# EAGLE design bredtoob (EAGLE 9.6.2)
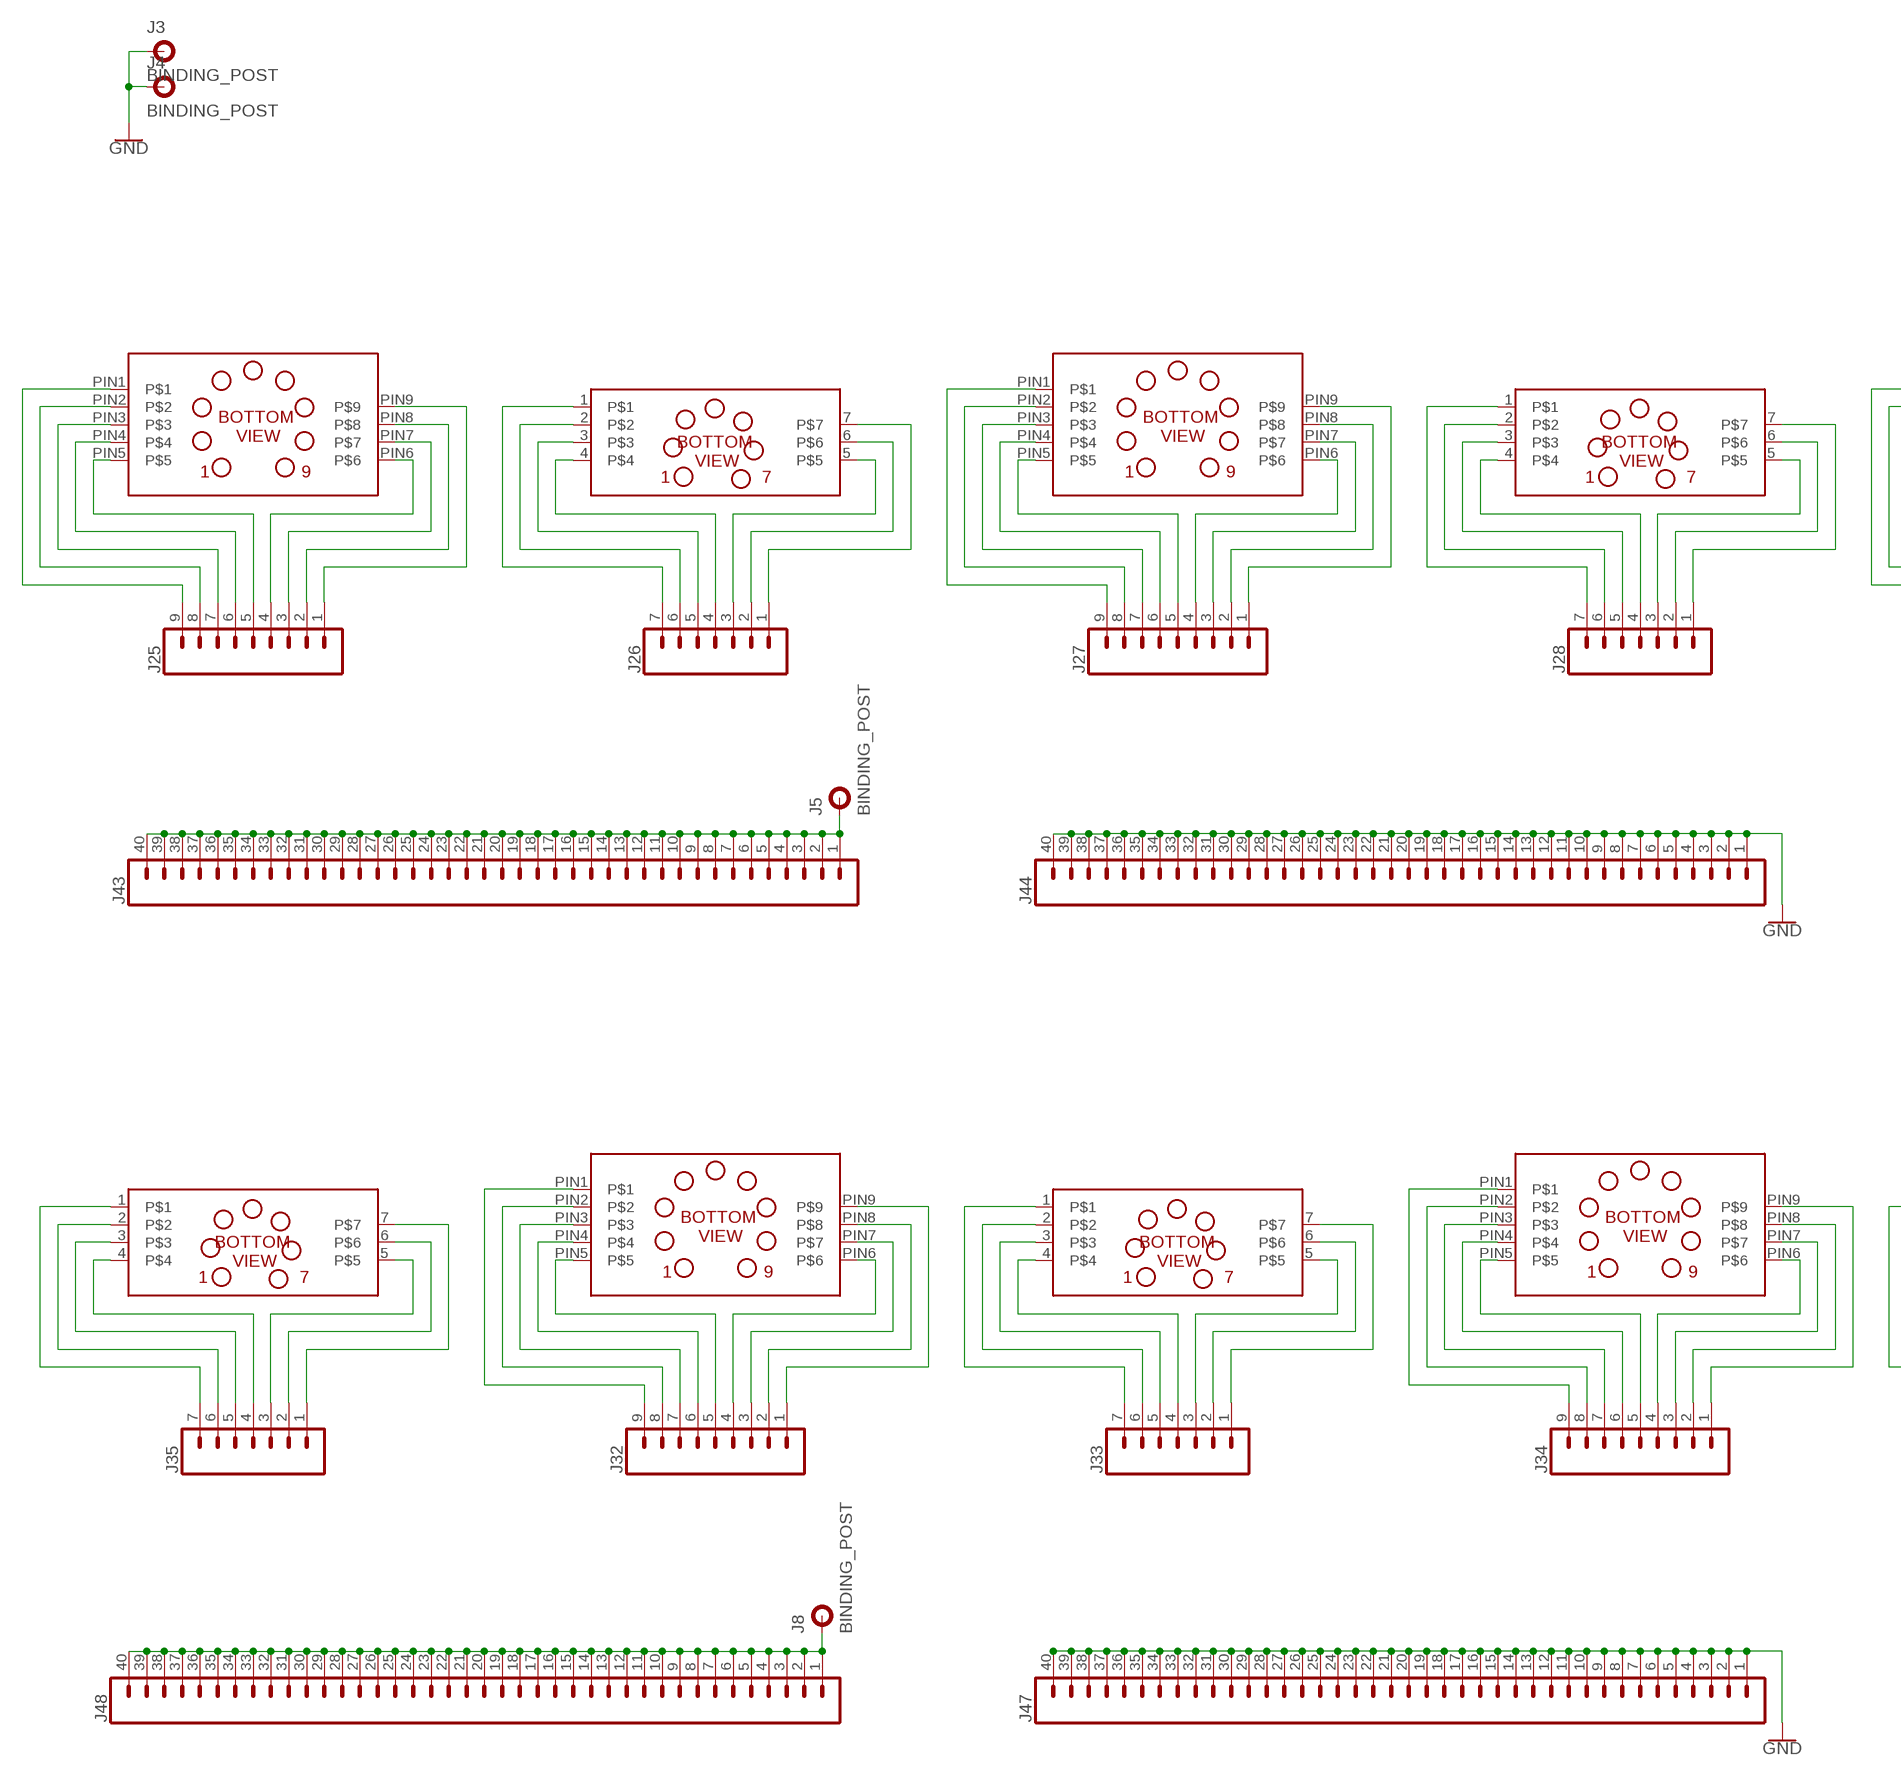
[diagram p0: schematic, sheet 1, part 1 of 2]
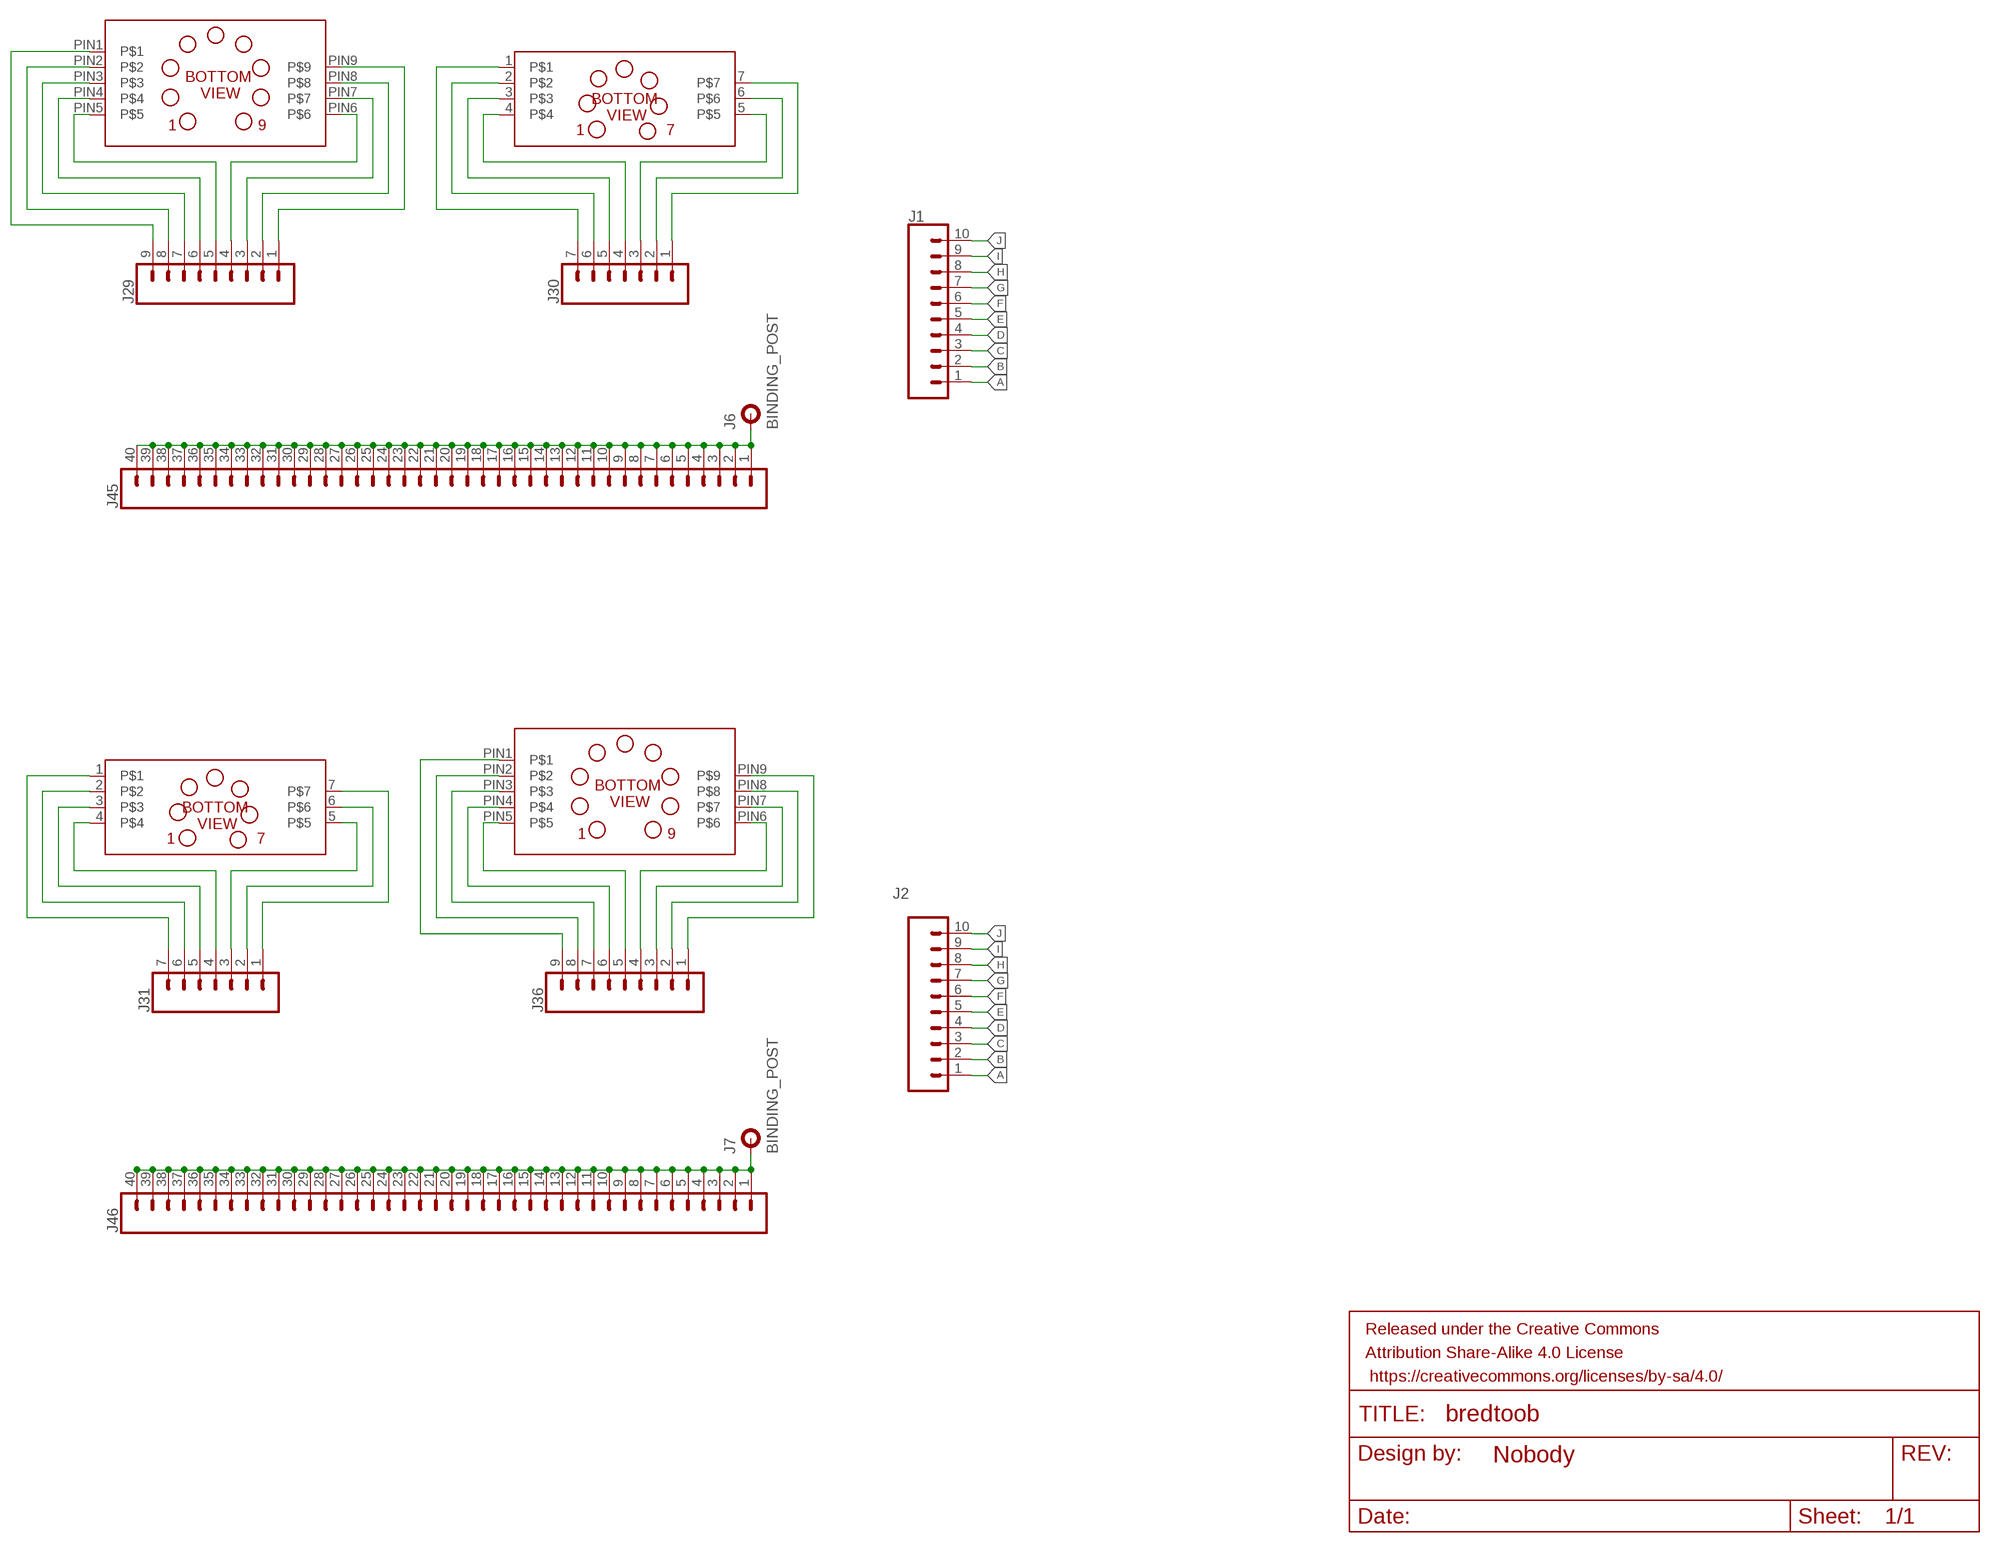
[diagram p1: schematic, sheet 1, part 2 of 2]

## Parts
FRAME1  FRAME-LETTERNO_PACKAGE  [DUMMY]
J1  CONN_10NO_SILK_PTH_FEMALE  [1X10_NO_SILK]
J2  CONN_10NO_SILK_PTH_FEMALE  [1X10_NO_SILK]
J3  BINDING_POST  [BINDING_POST]
J4  BINDING_POST  [BINDING_POST]
J5  BINDING_POST  [BINDING_POST]
J6  BINDING_POST  [BINDING_POST]
J7  BINDING_POST  [BINDING_POST]
J8  BINDING_POST  [BINDING_POST]
J25  CONN_09  [1X09]
J26  CONN_07NO_SILK  [1X07_NO_SILK]
J27  CONN_09  [1X09]
J28  CONN_07NO_SILK  [1X07_NO_SILK]
J29  CONN_09  [1X09]
J30  CONN_07NO_SILK  [1X07_NO_SILK]
J31  CONN_07NO_SILK  [1X07_NO_SILK]
J32  CONN_09  [1X09]
J33  CONN_07NO_SILK  [1X07_NO_SILK]
J34  CONN_09  [1X09]
J35  CONN_07NO_SILK  [1X07_NO_SILK]
J36  CONN_09  [1X09]
J43  CONN_40  [1X40]
J44  CONN_40  [1X40]
J45  CONN_40  [1X40]
J46  CONN_40  [1X40]
J47  CONN_40  [1X40]
J48  CONN_40  [1X40]
U$1  9PINMINI  [9-PIN-MINIATURE]
U$2  7PINMINI  [7-PIN-MINIATURE(B7G)]
U$3  9PINMINI  [9-PIN-MINIATURE]
U$4  7PINMINI  [7-PIN-MINIATURE(B7G)]
U$5  9PINMINI  [9-PIN-MINIATURE]
U$6  7PINMINI  [7-PIN-MINIATURE(B7G)]
U$7  7PINMINI  [7-PIN-MINIATURE(B7G)]
U$8  9PINMINI  [9-PIN-MINIATURE]
U$9  7PINMINI  [7-PIN-MINIATURE(B7G)]
U$10  9PINMINI  [9-PIN-MINIATURE]
U$11  7PINMINI  [7-PIN-MINIATURE(B7G)]
U$12  9PINMINI  [9-PIN-MINIATURE]

## Nets
A: J1.1 J2.1
B: J1.2 J2.2
C: J1.3 J2.3
D: J1.4 J2.4
E: J1.5 J2.5
F: J1.6 J2.6
G: J1.7 J2.7
GND: J3.P$1 J4.P$1 J44.1 J44.2 J44.3 J44.4 J44.5 J44.6 J44.7 J44.8 J44.9 J44.10 J44.11 J44.12 J44.13 J44.14 J44.15 J44.16 J44.17 J44.18 J44.19 J44.20 J44.21 J44.22 J44.23 J44.24 J44.25 J44.26 J44.27 J44.28 J44.29 J44.30 J44.31 J44.32 J44.33 J44.34 J44.35 J44.36 J44.37 J44.38 J44.39 J44.40 J47.1 J47.2 J47.3 J47.4 J47.5 J47.6 J47.7 J47.8 J47.9 J47.10 J47.11 J47.12 J47.13 J47.14 J47.15 J47.16 J47.17 J47.18 J47.19 J47.20 J47.21 J47.22 J47.23 J47.24 J47.25 J47.26 J47.27 J47.28 J47.29 J47.30 J47.31 J47.32 J47.33 J47.34 J47.35 J47.36 J47.37 J47.38 J47.39 J47.40
H: J1.8 J2.8
I: J1.9 J2.9
J: J1.10 J2.10
N$1: J5.P$1 J43.1 J43.2 J43.3 J43.4 J43.5 J43.6 J43.7 J43.8 J43.9 J43.10 J43.11 J43.12 J43.13 J43.14 J43.15 J43.16 J43.17 J43.18 J43.19 J43.20 J43.21 J43.22 J43.23 J43.24 J43.25 J43.26 J43.27 J43.28 J43.29 J43.30 J43.31 J43.32 J43.33 J43.34 J43.35 J43.36 J43.37 J43.38 J43.39 J43.40
N$2: J6.P$1 J45.1 J45.2 J45.3 J45.4 J45.5 J45.6 J45.7 J45.8 J45.9 J45.10 J45.11 J45.12 J45.13 J45.14 J45.15 J45.16 J45.17 J45.18 J45.19 J45.20 J45.21 J45.22 J45.23 J45.24 J45.25 J45.26 J45.27 J45.28 J45.29 J45.30 J45.31 J45.32 J45.33 J45.34 J45.35 J45.36 J45.37 J45.38 J45.39 J45.40
N$3: J7.P$1 J46.1 J46.2 J46.3 J46.4 J46.5 J46.6 J46.7 J46.8 J46.9 J46.10 J46.11 J46.12 J46.13 J46.14 J46.15 J46.16 J46.17 J46.18 J46.19 J46.20 J46.21 J46.22 J46.23 J46.24 J46.25 J46.26 J46.27 J46.28 J46.29 J46.30 J46.31 J46.32 J46.33 J46.34 J46.35 J46.36 J46.37 J46.38 J46.39 J46.40
N$4: J8.P$1 J48.1 J48.2 J48.3 J48.4 J48.5 J48.6 J48.7 J48.8 J48.9 J48.10 J48.11 J48.12 J48.13 J48.14 J48.15 J48.16 J48.17 J48.18 J48.19 J48.20 J48.21 J48.22 J48.23 J48.24 J48.25 J48.26 J48.27 J48.28 J48.29 J48.30 J48.31 J48.32 J48.33 J48.34 J48.35 J48.36 J48.37 J48.38 J48.39 J48.40
N$7: J25.9 U$1.PIN1
N$8: J25.8 U$1.PIN2
N$9: J25.7 U$1.PIN3
N$10: J25.6 U$1.PIN4
N$11: J25.5 U$1.PIN5
N$12: J25.4 U$1.PIN6
N$13: J25.3 U$1.PIN7
N$14: J25.2 U$1.PIN8
N$15: J25.1 U$1.PIN9
N$17: J26.7 U$2.1
N$18: J26.6 U$2.2
N$19: J26.5 U$2.3
N$20: J26.4 U$2.4
N$21: J26.3 U$2.5
N$22: J26.2 U$2.6
N$23: J26.1 U$2.7
N$25: J27.9 U$3.PIN1
N$26: J27.8 U$3.PIN2
N$27: J27.7 U$3.PIN3
N$28: J27.6 U$3.PIN4
N$29: J27.5 U$3.PIN5
N$30: J27.4 U$3.PIN6
N$31: J27.3 U$3.PIN7
N$32: J27.2 U$3.PIN8
N$33: J27.1 U$3.PIN9
N$35: J28.7 U$4.1
N$36: J28.6 U$4.2
N$37: J28.5 U$4.3
N$38: J28.4 U$4.4
N$39: J28.3 U$4.5
N$40: J28.2 U$4.6
N$41: J28.1 U$4.7
N$43: J29.9 U$5.PIN1
N$44: J29.8 U$5.PIN2
N$45: J29.7 U$5.PIN3
N$46: J29.6 U$5.PIN4
N$47: J29.5 U$5.PIN5
N$48: J29.4 U$5.PIN6
N$49: J29.3 U$5.PIN7
N$50: J29.2 U$5.PIN8
N$51: J29.1 U$5.PIN9
N$53: J30.7 U$6.1
N$54: J30.6 U$6.2
N$55: J30.5 U$6.3
N$56: J30.4 U$6.4
N$57: J30.3 U$6.5
N$58: J30.2 U$6.6
N$59: J30.1 U$6.7
N$62: J35.7 U$7.1
N$63: J35.6 U$7.2
N$64: J35.5 U$7.3
N$65: J35.4 U$7.4
N$66: J35.3 U$7.5
N$67: J35.2 U$7.6
N$68: J35.1 U$7.7
N$70: J32.9 U$8.PIN1
N$71: J32.8 U$8.PIN2
N$72: J32.7 U$8.PIN3
N$73: J32.6 U$8.PIN4
N$74: J32.5 U$8.PIN5
N$75: J32.4 U$8.PIN6
N$76: J32.3 U$8.PIN7
N$77: J32.2 U$8.PIN8
N$78: J32.1 U$8.PIN9
N$80: J33.7 U$9.1
N$81: J33.6 U$9.2
N$82: J33.5 U$9.3
N$83: J33.4 U$9.4
N$84: J33.3 U$9.5
N$85: J33.2 U$9.6
N$86: J33.1 U$9.7
N$88: J34.9 U$10.PIN1
N$89: J34.8 U$10.PIN2
N$90: J34.7 U$10.PIN3
N$91: J34.6 U$10.PIN4
N$92: J34.5 U$10.PIN5
N$93: J34.4 U$10.PIN6
N$94: J34.3 U$10.PIN7
N$95: J34.2 U$10.PIN8
N$96: J34.1 U$10.PIN9
N$98: J31.7 U$11.1
N$99: J31.6 U$11.2
N$100: J31.5 U$11.3
N$101: J31.4 U$11.4
N$102: J31.3 U$11.5
N$103: J31.2 U$11.6
N$104: J31.1 U$11.7
N$106: J36.9 U$12.PIN1
N$107: J36.8 U$12.PIN2
N$108: J36.7 U$12.PIN3
N$109: J36.6 U$12.PIN4
N$110: J36.5 U$12.PIN5
N$111: J36.4 U$12.PIN6
N$112: J36.3 U$12.PIN7
N$113: J36.2 U$12.PIN8
N$114: J36.1 U$12.PIN9

## Library data of the parts
FRAME1 = SparkFun-Aesthetics:FRAME-LETTER: Schematic Frame - Letter Standard 8.5x11 US Letter frame; DESIGNER: Nobody; VERSION: v01
J1 J2 = SparkFun-Connectors:CONN_10: Multi connection point. Often used as Generic Header-pin footprint for 0.1 inch spaced/style header connections On any of the 0.1 inch spaced packages, you can populate with these: Break Away Headers - Straight (PRT-00116) Break Away Male Headers - Right Angle (PRT-00553) Female Headers (PRT-00115) Break Away Headers - Machine Pin (PRT-00117) Break Away Female Headers - Swiss Machine Pin (PRT-00743) Arduino Stackable Header - 10 Pin (PRT-11376) For SCREWTERMINALS and SPRING TERMINALS visit here: Screw Terimnals on SparkFun.com (5mm/3.5mm/2.54mm spacing) This device is also useful as a general connection point to wire up your design to another part of your project. Our various solder wires solder well into these plated through hole pads. Hook-Up Wire - Assortment (Stranded, 22 AWG) (PRT-11375) Hook-Up Wire - Assortment (Solid Core, 22 AWG) (PRT-11367) View the entire wire category on our website here Special notes: Molex polarized connector foot print use with SKU : PRT-08231 with associated crimp pins and housings. 1MM SMD Version SKU: PRT-10208 NOTES ON THE VARIANTS LOCK and LOCK_LONGPADS... This footprint was designed to help hold the alignment of a through-hole component (i.e. 6-pin header) while soldering it into place. You may notice that each hole has been shifted either up or down by 0.005 of an inch from it's more standard position (which is a perfectly straight line). This slight alteration caused the pins (the squares in the middle) to touch the edges of the holes. Because they are alternating, it causes a "brace" to hold the component in place. 0.005 has proven to be the perfect amount of "off-center" position when using our standard breakaway headers. Although looks a little odd when you look at the bare footprint, once you have a header in there, the alteration is very hard to notice. Also,if you push a header all the way into place, it is covered up entirely on the bottom side.
J3-J8 = SparkFun-Connectors:BINDING_POST: Binding Post The component itself has an threaded, insulated body that goes through the board, with a small threaded metal stud coming off the back. The intent of this package is that the post goes through a milled obling hole, and a small wire would be used to connect from the PCB pad to the metal contact on the post. SparkFun Products: SparkFun Decade Resistance Box <https://www.sparkfun.com/products/13006> SparkFun Benchtop Power Board Kit <https://www.sparkfun.com/products/12867> Binding Post - Red <https://www.sparkfun.com/products/9739> Binding Post - Black <https://www.sparkfun.com/products/9740>; PROD_ID: CONN-09675; SF_ID: PRT-09740
J25 J27 J29 J32 J34 J36 = SparkFun-Connectors:CONN_09: Multi connection point. Often used as Generic Header-pin footprint for 0.1 inch spaced/style header connections On any of the 0.1 inch spaced packages, you can populate with these: Break Away Headers - Straight (PRT-00116) Break Away Male Headers - Right Angle (PRT-00553) Female Headers (PRT-00115) Break Away Headers - Machine Pin (PRT-00117) Break Away Female Headers - Swiss Machine Pin (PRT-00743) For SCREWTERMINALS and SPRING TERMINALS visit here: Screw Terimnals on SparkFun.com (5mm/3.5mm/2.54mm spacing) This device is also useful as a general connection point to wire up your design to another part of your project. Our various solder wires solder well into these plated through hole pads. Hook-Up Wire - Assortment (Stranded, 22 AWG) (PRT-11375) Hook-Up Wire - Assortment (Solid Core, 22 AWG) (PRT-11367) View the entire wire category on our website here Special notes: Molex polarized connector foot print use with SKU : PRT-08231 with associated crimp pins and housings. 1MM SMD Version SKU: PRT-10208 NOTES ON THE VARIANTS LOCK and LOCK_LONGPADS... This footprint was designed to help hold the alignment of a through-hole component (i.e. 6-pin header) while soldering it into place. You may notice that each hole has been shifted either up or down by 0.005 of an inch from it's more standard position (which is a perfectly straight line). This slight alteration caused the pins (the squares in the middle) to touch the edges of the holes. Because they are alternating, it causes a "brace" to hold the component in place. 0.005 has proven to be the perfect amount of "off-center" position when using our standard breakaway headers. Although looks a little odd when you look at the bare footprint, once you have a header in there, the alteration is very hard to notice. Also,if you push a header all the way into place, it is covered up entirely on the bottom side.
J26 J28 J30 J31 J33 J35 = SparkFun-Connectors:CONN_07: Multi connection point. Often used as Generic Header-pin footprint for 0.1 inch spaced/style header connections On any of the 0.1 inch spaced packages, you can populate with these: Break Away Headers - Straight (PRT-00116) Break Away Male Headers - Right Angle (PRT-00553) Female Headers (PRT-00115) Break Away Headers - Machine Pin (PRT-00117) Break Away Female Headers - Swiss Machine Pin (PRT-00743) For SCREWTERMINALS and SPRING TERMINALS visit here: Screw Terimnals on SparkFun.com (5mm/3.5mm/2.54mm spacing) This device is also useful as a general connection point to wire up your design to another part of your project. Our various solder wires solder well into these plated through hole pads. Hook-Up Wire - Assortment (Stranded, 22 AWG) (PRT-11375) Hook-Up Wire - Assortment (Solid Core, 22 AWG) (PRT-11367) View the entire wire category on our website here Special notes: Molex polarized connector foot print use with SKU : PRT-08231 with associated crimp pins and housings. 1MM SMD Version SKU: PRT-10208 NOTES ON THE VARIANTS LOCK and LOCK_LONGPADS... This footprint was designed to help hold the alignment of a through-hole component (i.e. 6-pin header) while soldering it into place. You may notice that each hole has been shifted either up or down by 0.005 of an inch from it's more standard position (which is a perfectly straight line). This slight alteration caused the pins (the squares in the middle) to touch the edges of the holes. Because they are alternating, it causes a "brace" to hold the component in place. 0.005 has proven to be the perfect amount of "off-center" position when using our standard breakaway headers. Although looks a little odd when you look at the bare footprint, once you have a header in there, the alteration is very hard to notice. Also,if you push a header all the way into place, it is covered up entirely on the bottom side.
J43-J48 = SparkFun-Connectors:CONN_40: Multi connection point. Often used as Generic Header-pin footprint for 0.1 inch spaced/style header connections On any of the 0.1 inch spaced packages, you can populate with these: Break Away Headers - Straight (PRT-00116) Break Away Male Headers - Right Angle (PRT-00553) Female Headers (PRT-00115) Break Away Headers - Machine Pin (PRT-00117) Break Away Female Headers - Swiss Machine Pin (PRT-00743) For SCREWTERMINALS and SPRING TERMINALS visit here: Screw Terimnals on SparkFun.com (5mm/3.5mm/2.54mm spacing) This device is also useful as a general connection point to wire up your design to another part of your project. Our various solder wires solder well into these plated through hole pads. Hook-Up Wire - Assortment (Stranded, 22 AWG) (PRT-11375) Hook-Up Wire - Assortment (Solid Core, 22 AWG) (PRT-11367) View the entire wire category on our website here Special notes: Molex polarized connector foot print use with SKU : PRT-08231 with associated crimp pins and housings. 1MM SMD Version SKU: PRT-10208 NOTES ON THE VARIANTS LOCK and LOCK_LONGPADS... This footprint was designed to help hold the alignment of a through-hole component (i.e. 6-pin header) while soldering it into place. You may notice that each hole has been shifted either up or down by 0.005 of an inch from it's more standard position (which is a perfectly straight line). This slight alteration caused the pins (the squares in the middle) to touch the edges of the holes. Because they are alternating, it causes a "brace" to hold the component in place. 0.005 has proven to be the perfect amount of "off-center" position when using our standard breakaway headers. Although looks a little odd when you look at the bare footprint, once you have a header in there, the alteration is very hard to notice. Also,if you push a header all the way into place, it is covered up entirely on the bottom side.
U$1 U$3 U$5 U$8 U$10 U$12 = Toob:9PINMINI
U$2 U$4 U$6 U$7 U$9 U$11 = Toob:7PINMINI

## Board
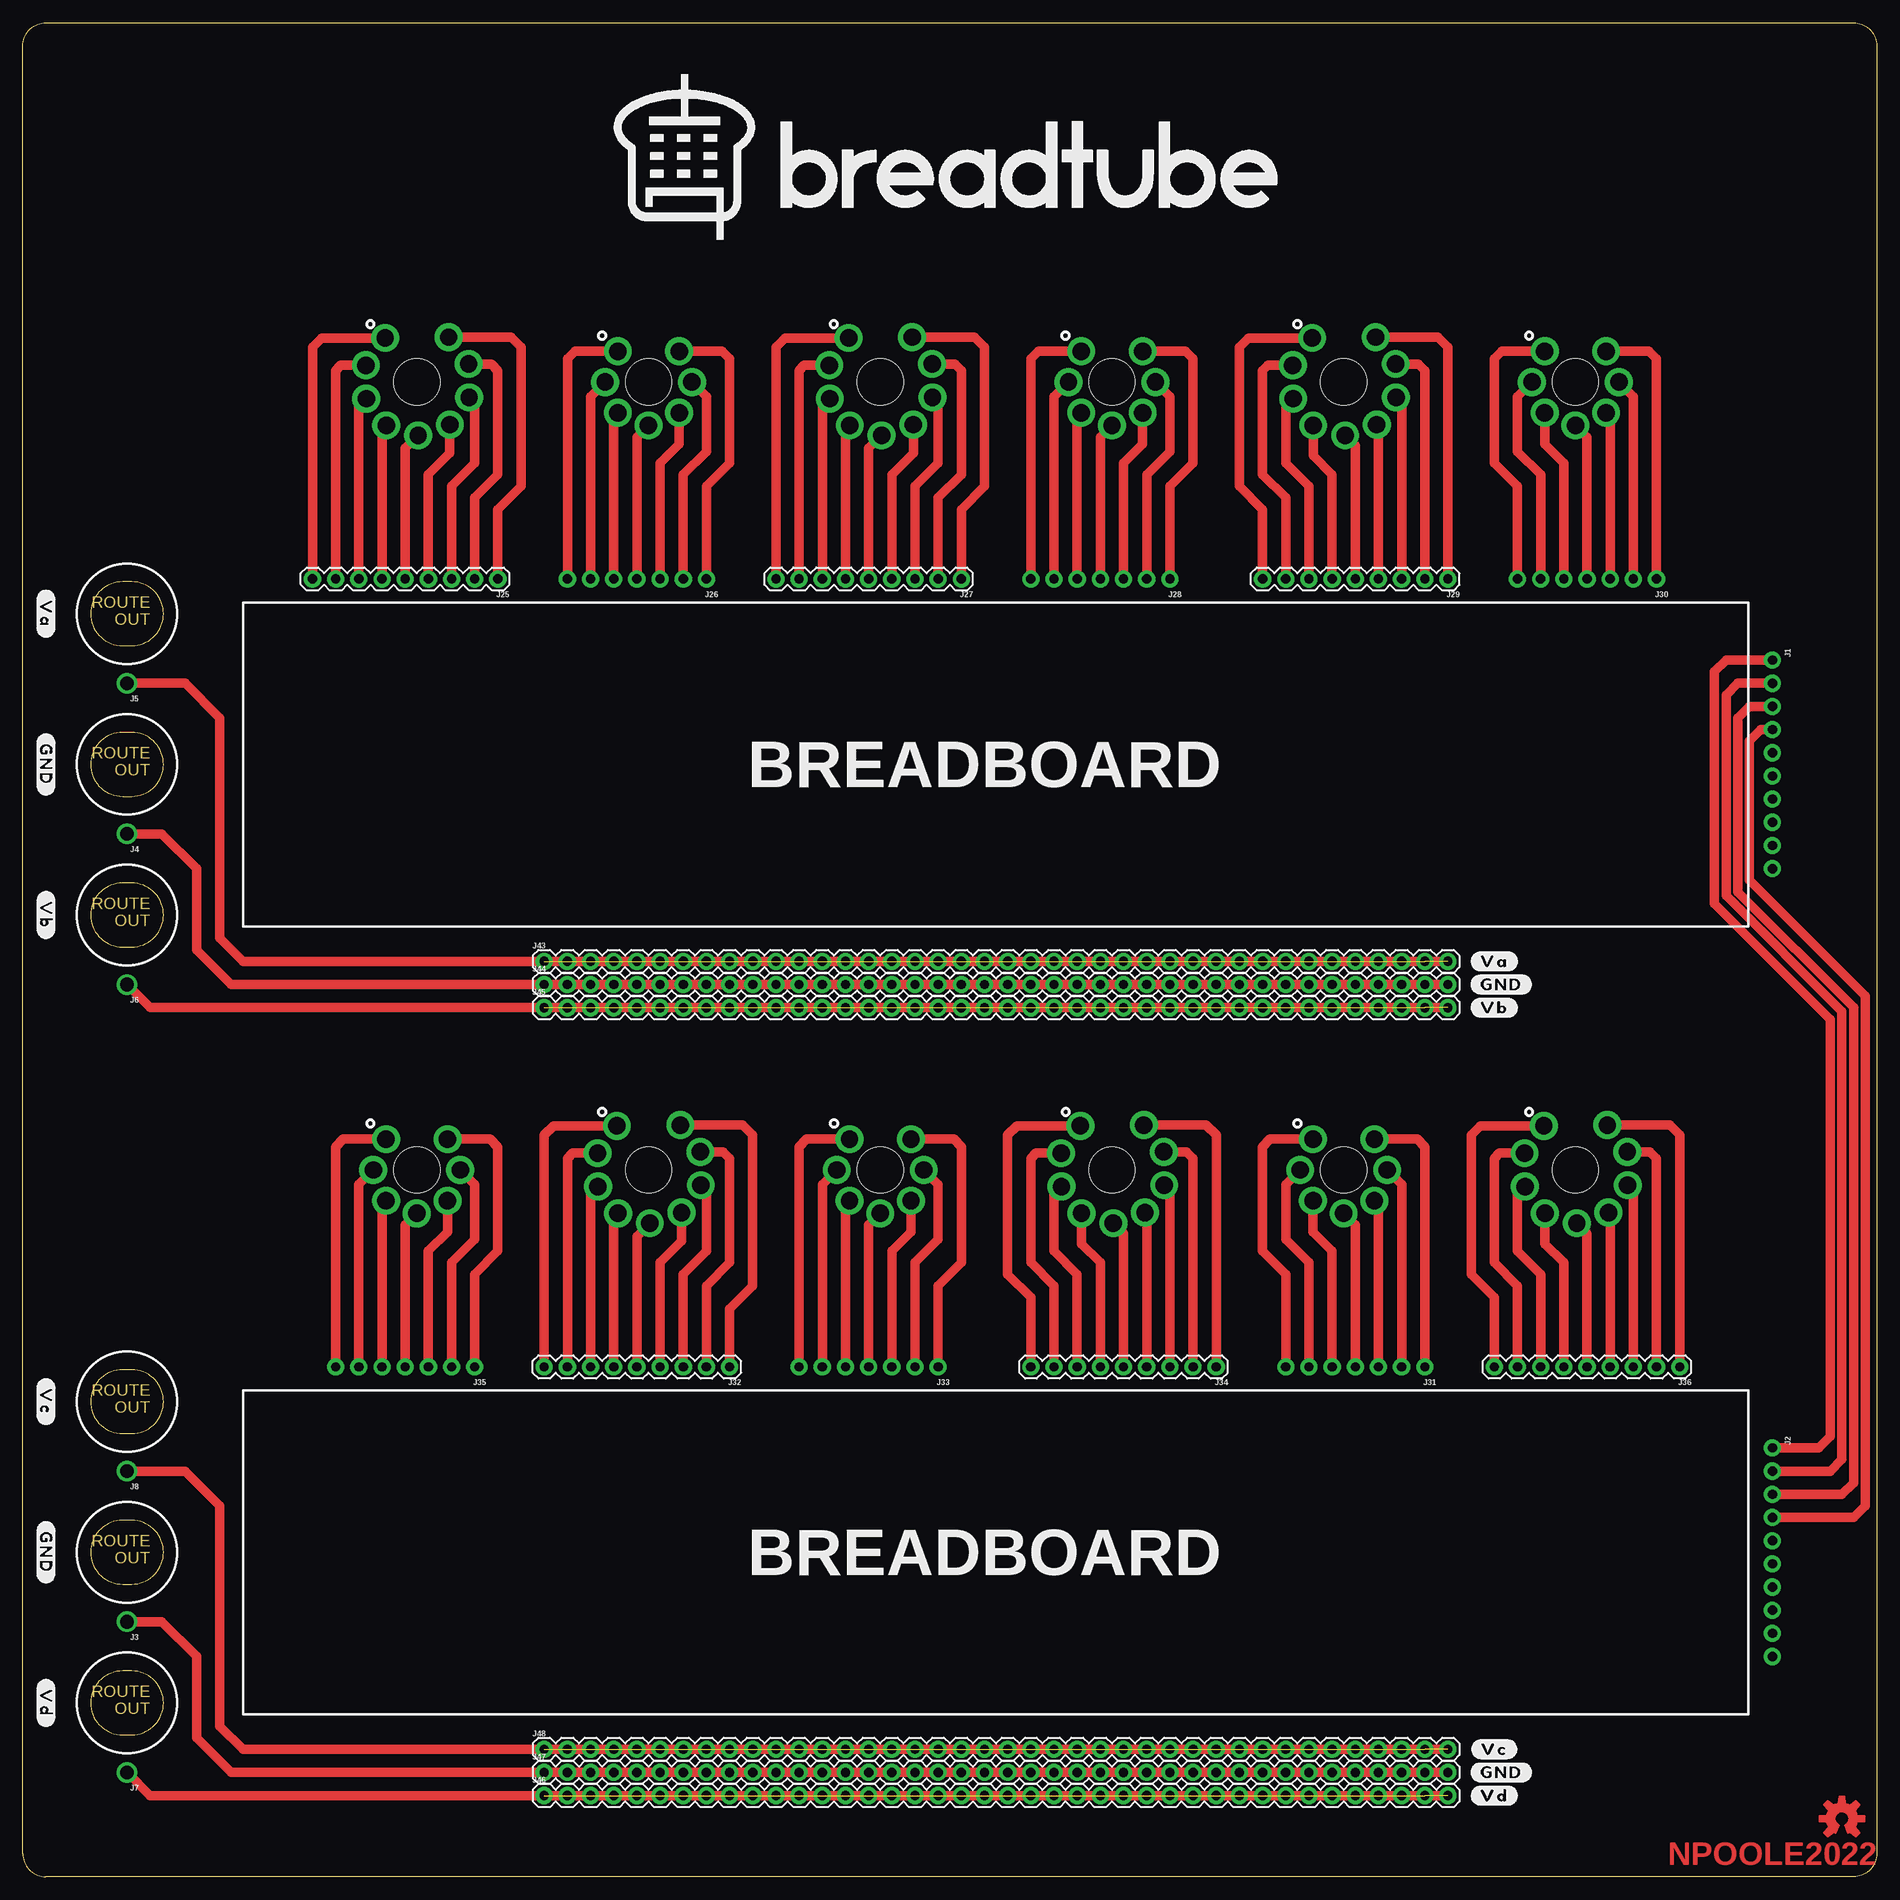
[diagram p2: board, top side]
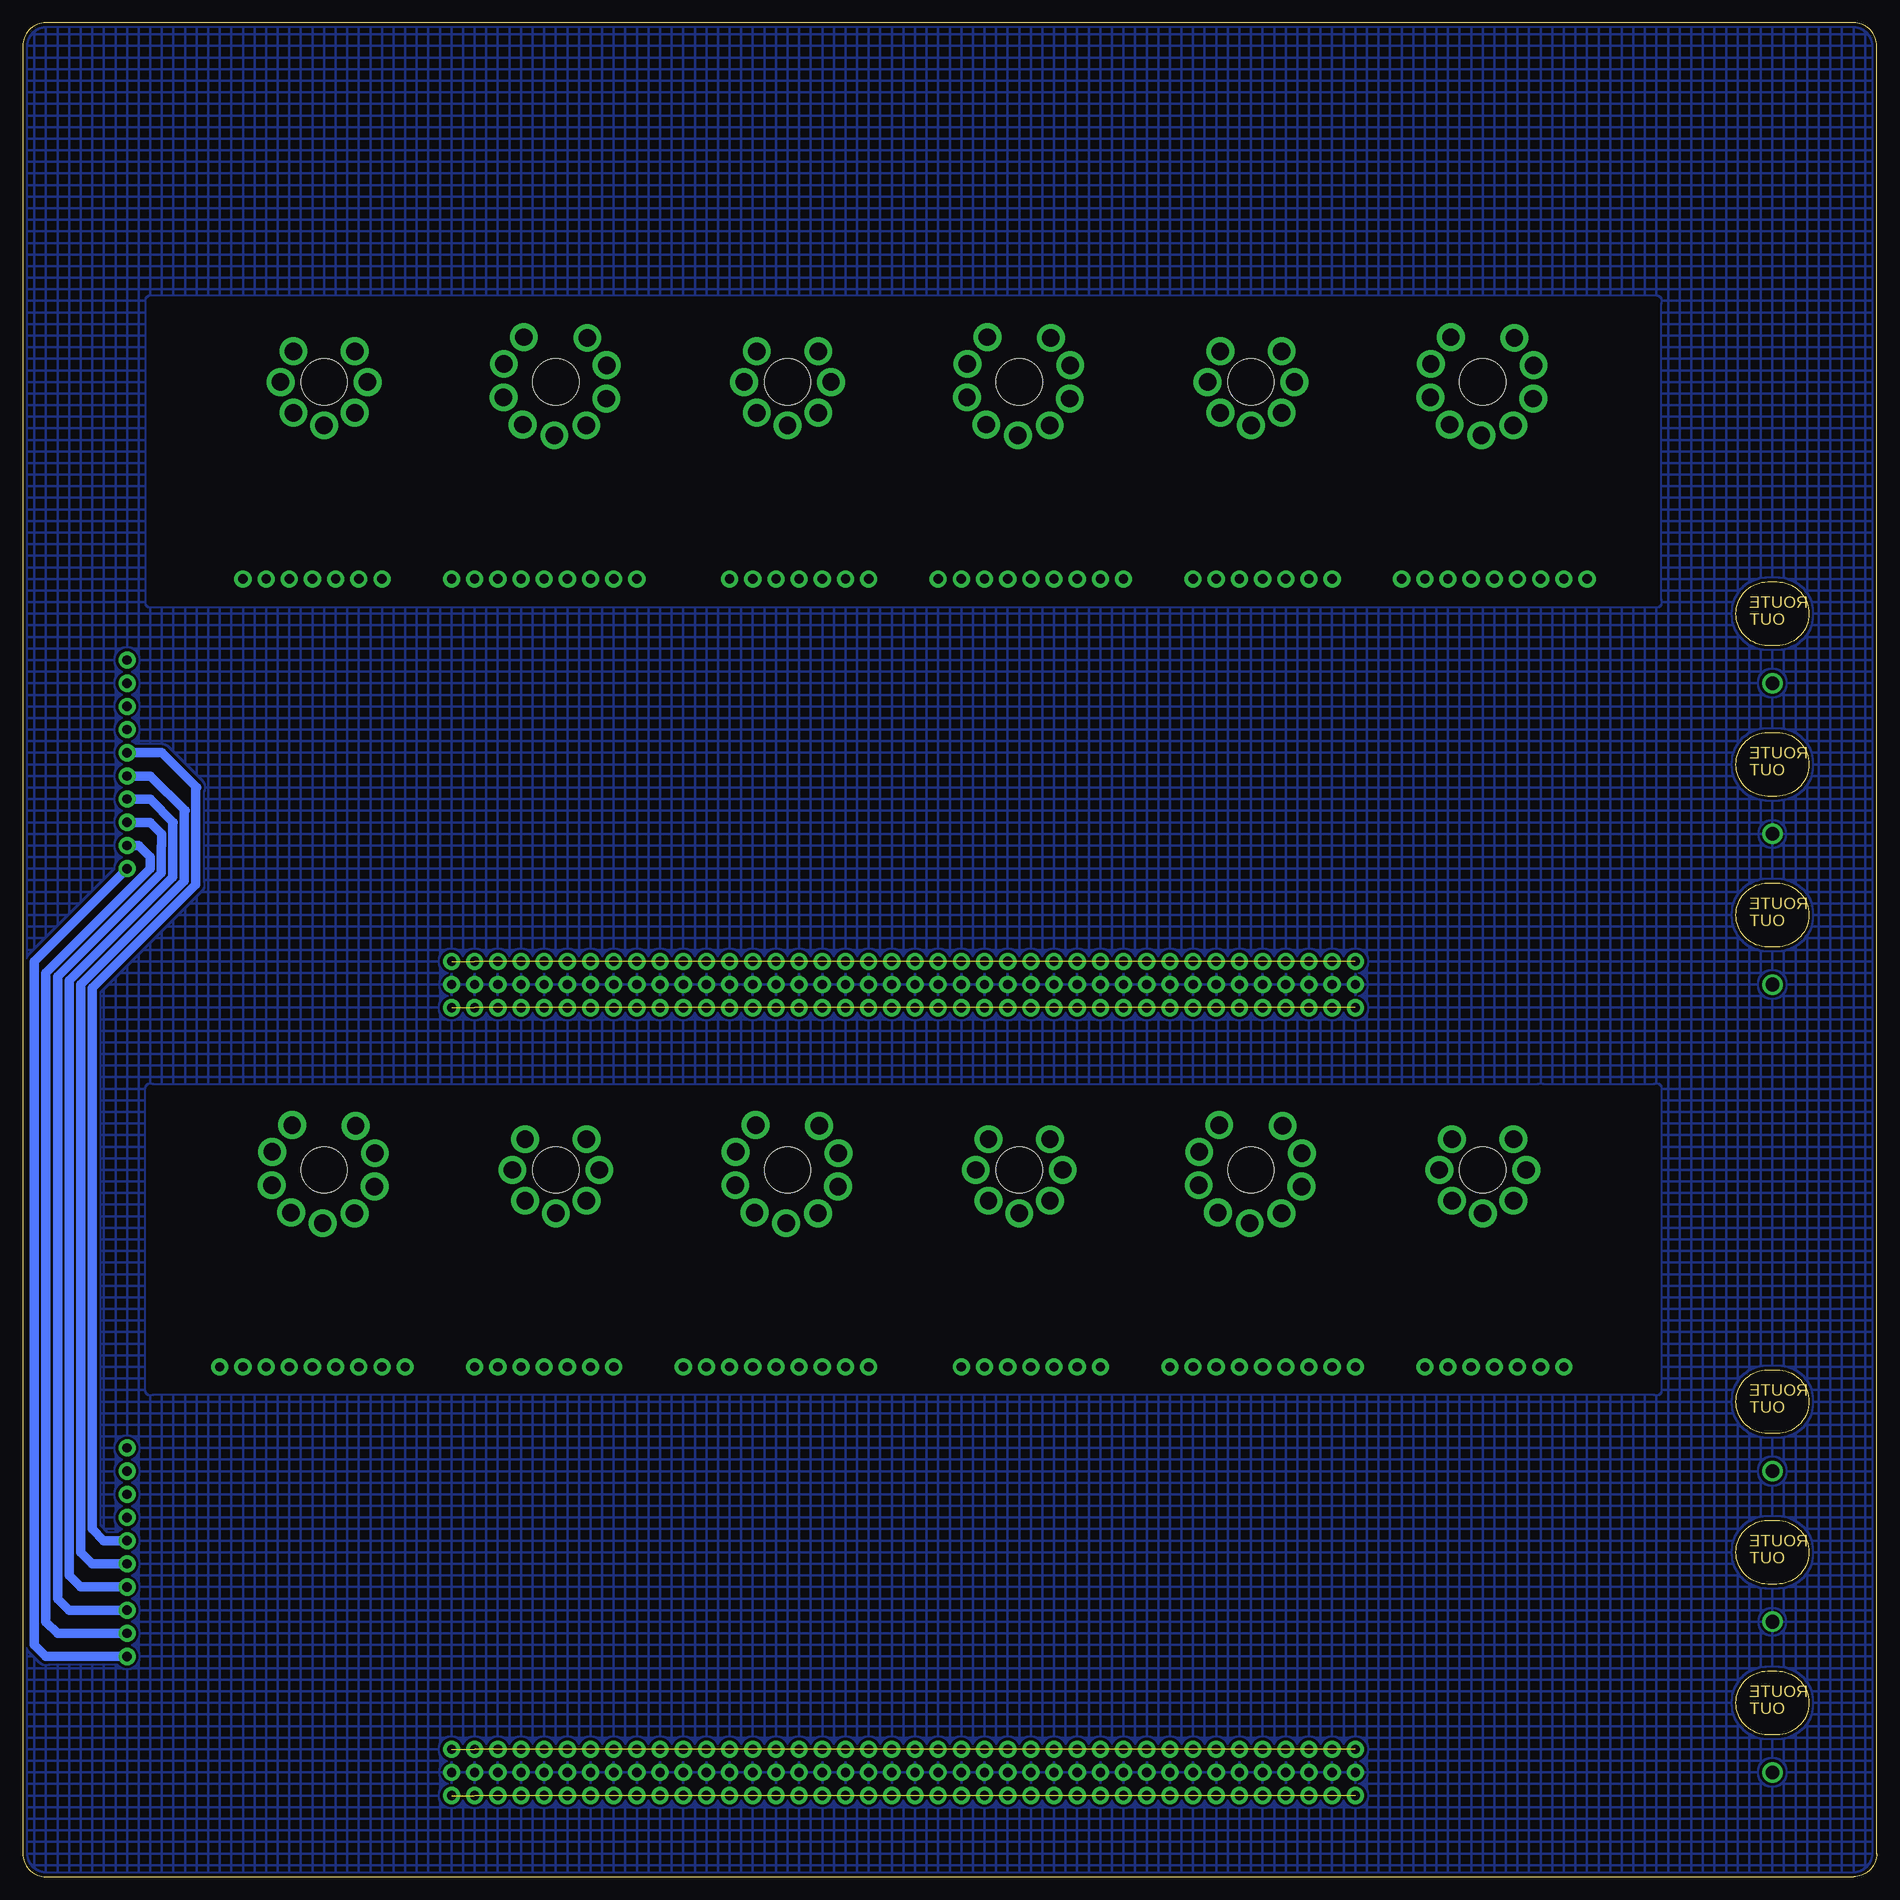
[diagram p3: board, bottom side, seen from below]

Size 203.2 x 203.2 mm. Coordinates in mm from the lower left corner, seen from the top.
Outline: 0,2.54 0,200.66 arc-90 2.54,203.2 200.66,203.2 arc-90 203.2,200.66 203.2,2.54 arc-90 200.66,0 2.54,0 arc-90 0,2.54
Copper layers (1*16): Top 0.035mm / dielectric 1.5mm / Bottom 0.035mm
Design rules "SparkFun-2-Layer-General-JLCPCB": minimum track width 7mil, minimum drill 0.3mm, track to track 7mil, track to pad 7mil, pad to pad 7mil, via to via 7mil, smd to smd 7mil, copper to edge 7mil, drill to drill 7mil, minimum pad ring 7mil, minimum via ring 7mil, stop-mask expansion 4mil, vias tented up to drill 25mil, thermal gap 10mil
bRestrict: area 24.1,139.7 to 189.2,172.7; area 24.1,53.3 to 189.2,86.4

### Footprints (pad centres in the part's own frame; a part is rotated, then mirrored left to right if it is on the bottom)
1X10_NO_SILK = drill 1.016 pad 1.88: 1 0,0; 2 2.54,0; 3 5.08,0; 4 7.62,0; 5 10.16,0; 6 12.7,0; 7 15.24,0; 8 17.78,0; 9 20.32,0; 10 22.86,0
BINDING_POST = drill 1.5: P$1 0,7.62
1X09 = drill 1.016 pad 1.88: 1 0,0; 2 2.54,0; 3 5.08,0; 4 7.62,0; 5 10.16,0; 6 12.7,0; 7 15.24,0; 8 17.78,0; 9 20.32,0
1X07_NO_SILK = drill 1.016 pad 1.88: 1 0,0; 2 2.54,0; 3 5.08,0; 4 7.62,0; 5 10.16,0; 6 12.7,0; 7 15.24,0
1X40 = drill 1.016 pad 1.88: 1 0,0; 2 2.54,0; 3 5.08,0; 4 7.62,0; 5 10.16,0; 6 12.7,0; 7 15.24,0; 8 17.78,0; 9 20.32,0; 10 22.86,0; 11 25.4,0; 12 27.94,0; 13 30.48,0; 14 33.02,0; 15 35.56,0; 16 38.1,0; 17 40.64,0; 18 43.18,0; 19 45.72,0; 20 48.26,0; 21 50.8,0; 22 53.34,0; 23 55.88,0; 24 58.42,0; 25 60.96,0; 26 63.5,0; 27 66.04,0; 28 68.58,0; 29 71.12,0; 30 73.66,0; 31 76.2,0; 32 78.74,0; 33 81.28,0; 34 83.82,0; 35 86.36,0; 36 88.9,0; 37 91.44,0; 38 93.98,0; 39 96.52,0; 40 99.06,0
9-PIN-MINIATURE = drill 1.905 pad 3.048: PIN1 3.467,-4.823; PIN2 5.58,-1.834; PIN3 5.532,1.827; PIN4 3.342,4.76; PIN5 -0.154,5.846; PIN6 -3.621,4.669; PIN7 -5.734,1.68; PIN8 -5.686,-1.981; PIN9 -3.496,-4.914 | hole 5.08: 0,0
7-PIN-MINIATURE(B7G) = drill 1.905 pad 3.048: 1 3.368,-3.368; 2 4.763,0; 3 3.368,3.368; 4 0,4.763; 5 -3.368,3.368; 6 -4.763,0; 7 -3.368,-3.368 | hole 5.08: 0,0

### Placement (x,y rotation side)
FRAME1  24.13,17.78 0 top
FRAME2  FRAME-LETTERNO_PACKAGE  [DUMMY]  24.13,104.14 0 top
J1  191.77,133.35 270 top
J2  191.77,46.99 270 top
J3  11.43,35.56 180 top
J4  11.43,121.92 180 top
J5  11.43,138.43 180 top
J6  11.43,105.41 180 top
J7  11.43,19.05 180 top
J8  11.43,52.07 180 top
J25  52.07,142.24 180 top
J26  74.93,142.24 180 top
J27  102.87,142.24 180 top
J28  125.73,142.24 180 top
J29  156.21,142.24 180 top
J30  179.07,142.24 180 top
J31  153.67,55.88 180 top
J32  77.47,55.88 180 top
J33  100.33,55.88 180 top
J34  130.81,55.88 180 top
J35  49.53,55.88 180 top
J36  181.61,55.88 180 top
J43  57.15,100.33 0 top
J44  57.15,97.79 0 top
J45  57.15,95.25 0 top
J46  57.15,8.89 0 top
J47  57.15,11.43 0 top
J48  57.15,13.97 0 top
U$1  43.18,163.83 180 top
U$2  68.58,163.83 180 top
U$3  93.98,163.83 180 top
U$4  119.38,163.83 180 top
U$5  144.78,163.83 180 top
U$6  170.18,163.83 180 top
U$7  43.18,77.47 180 top
U$8  68.58,77.47 180 top
U$9  93.98,77.47 180 top
U$10  119.38,77.47 180 top
U$11  144.78,77.47 180 top
U$12  170.18,77.47 180 top
U$13  [LOGO#SVG0]  64.77,194.31 0 top
U$14  [#GND#0]  2.54,121.92 270 top
U$15  [#GND#0]  2.54,35.56 270 top
U$16  [#VA#0]  2.54,138.43 270 top
U$17  [#VB#0]  2.54,105.41 270 top
U$18  [#VC#0]  2.54,52.07 270 top
U$19  [#VD#0]  2.54,19.05 270 top
U$20  [#GND#0]  162.05,11.43 0 top
U$21  [#GND#0]  162.05,97.79 0 top
U$22  [#VA#0]  161.29,100.33 0 top
U$23  [#VB#0]  161.29,95.25 0 top
U$24  [#VC#0]  161.29,13.97 0 top
U$25  [#VD#0]  161.29,8.89 0 top
U$26  [OSHW-LOGO-M_COPPER]  199.39,6.35 0 top

### Tracks (layer width: path | path; a pad name or v marks a point on that pad's centre or on a via)
A
  Top 1.016: J2.1 196.85,46.99 198.12,48.26 198.12,93.98 185.42,106.68 185.42,132.08 186.69,133.35 J1.1
B
  Top 1.016: J2.2 198.12,44.45 199.39,45.72 199.39,94.83 186.69,107.53 186.69,129.54 187.96,130.81 J1.2
C
  Top 1.016: J2.3 199.39,41.91 200.66,43.18 200.66,95.25 187.96,107.95 187.96,127 189.23,128.27 J1.3
D
  Top 1.016: J2.4 200.66,39.37 201.93,40.64 201.93,96.52 189.23,109.22 189.23,124.46 190.5,125.73 J1.4
E
  Bottom 1.016: J2.5 194.31,36.83 195.58,38.1 195.58,97.39 184.23,108.74 184.23,119.3 184.15,119.38 187.96,123.19 J1.5
F
  Bottom 1.016: J2.6 195.58,34.29 196.85,35.56 196.85,97.81 185.5,109.16 185.5,116.76 185.42,116.84 189.23,120.65 J1.6
G
  Bottom 1.016: J2.7 196.85,31.75 198.12,33.02 198.12,98.22 186.77,109.58 186.77,115.49 186.69,115.57 189.23,118.11 J1.7
GND
  Top 1.016: J44.40 22.86,97.79 19.05,101.6 19.05,110.49 15.24,114.3 J4.P$1 | J47.40 22.86,11.43 19.05,15.24 19.05,20.32 19.05,24.13 15.24,27.94 J3.P$1
  pour Bottom (isolate 0.305, hatched): 0,203.2 203.2,203.2 203.2,0 0,0
H
  Bottom 1.016: J2.8 198.12,29.21 199.39,30.48 199.39,98.64 188.04,110 188.04,112.95 187.96,113.03 187.96,114.3 189.23,115.57 J1.8
I
  Bottom 1.016: J2.9 199.39,26.67 200.66,27.94 200.66,99.06 189.23,110.49 189.23,111.76 190.5,113.03 J1.9
J
  Bottom 1.016: J2.10 200.66,24.13 201.93,25.4 201.93,100.33 J1.10
N$1  (39 unrouted)
  Top 1.016: J43.40 24.13,100.33 21.59,102.87 21.59,127 17.78,130.81 J5.P$1
N$2  (39 unrouted)
  Top 1.016: J6.P$1 13.97,95.25 J45.40
N$3  (39 unrouted)
  Top 1.016: J7.P$1 13.97,8.89 J46.40
N$4  (39 unrouted)
  Top 1.016: J48.40 24.13,13.97 21.59,16.51 21.59,40.64 17.78,44.45 J8.P$1
N$7
  Top 1.016: U$1.PIN1 32.76,168.65 31.75,167.64 J25.9
N$8
  Top 1.016: U$1.PIN2 34.85,165.66 34.29,165.1 J25.8
N$9
  Top 1.016: U$1.PIN3 36.83,161.19 J25.7
N$10
  Top 1.016: U$1.PIN4 39.37,158.6 J25.6
N$11
  Top 1.016: U$1.PIN5 41.91,156.56 J25.5
N$12
  Top 1.016: U$1.PIN6 46.8,156.02 44.45,153.67 J25.4
N$13
  Top 1.016: U$1.PIN7 49.53,161.53 49.53,154.94 46.99,152.4 J25.3
N$14
  Top 1.016: U$1.PIN8 51.36,165.81 52.07,165.1 52.07,153.67 49.53,151.13 J25.2
N$15
  Top 1.016: U$1.PIN9 53.51,168.74 54.61,167.64 54.61,152.4 52.07,149.86 J25.1
N$17
  Top 1.016: U$2.1 60.52,167.2 59.69,166.37 J26.7
N$18
  Top 1.016: U$2.2 62.23,162.24 J26.6
N$19
  Top 1.016: U$2.3 64.77,160.02 J26.5
N$20
  Top 1.016: U$2.4 67.31,157.8 J26.4
N$21
  Top 1.016: U$2.5 71.95,157.04 69.85,154.94 J26.3
N$22
  Top 1.016: U$2.6 74.93,162.24 74.93,156.21 72.39,153.67 J26.2
N$23
  Top 1.016: U$2.7 76.64,167.2 77.47,166.37 77.47,154.94 74.93,152.4 J26.1
N$25
  Top 1.016: U$3.PIN1 83.56,168.65 82.55,167.64 J27.9
N$26
  Top 1.016: U$3.PIN2 85.65,165.66 85.09,165.1 J27.8
N$27
  Top 1.016: U$3.PIN3 87.63,161.19 J27.7
N$28
  Top 1.016: U$3.PIN4 90.17,158.6 J27.6
N$29
  Top 1.016: U$3.PIN5 92.71,156.56 J27.5
N$30
  Top 1.016: U$3.PIN6 97.6,156.02 95.25,153.67 J27.4
N$31
  Top 1.016: U$3.PIN7 100.33,161.53 100.33,154.94 97.79,152.4 J27.3
N$32
  Top 1.016: U$3.PIN8 102.16,165.81 102.87,165.1 102.87,153.67 100.33,151.13 J27.2
N$33
  Top 1.016: U$3.PIN9 104.31,168.74 105.41,167.64 105.41,152.4 102.87,149.86 J27.1
N$35
  Top 1.016: U$4.1 111.32,167.2 110.49,166.37 J28.7
N$36
  Top 1.016: U$4.2 113.03,162.24 J28.6
N$37
  Top 1.016: U$4.3 115.57,160.02 J28.5
N$38
  Top 1.016: U$4.4 118.11,157.8 J28.4
N$39
  Top 1.016: U$4.5 122.75,157.04 120.65,154.94 J28.3
N$40
  Top 1.016: U$4.6 125.73,162.24 125.73,156.21 123.19,153.67 J28.2
N$41
  Top 1.016: U$4.7 127.44,167.2 128.27,166.37 128.27,154.94 125.73,152.4 J28.1
N$43
  Top 1.016: U$5.PIN1 134.36,168.65 133.35,167.64 133.35,152.4 135.89,149.86 J29.9
N$44
  Top 1.016: U$5.PIN2 136.45,165.66 135.89,165.1 135.89,153.67 138.43,151.13 J29.8
N$45
  Top 1.016: U$5.PIN3 138.43,161.19 138.43,154.94 140.97,152.4 J29.7
N$46
  Top 1.016: U$5.PIN4 141.44,155.74 143.51,153.67 J29.6
N$47
  Top 1.016: U$5.PIN5 146.05,156.87 J29.5
N$48
  Top 1.016: U$5.PIN6 148.59,158.97 J29.4
N$49
  Top 1.016: U$5.PIN7 151.13,161.53 J29.3
N$50
  Top 1.016: U$5.PIN8 152.96,165.81 153.67,165.1 J29.2
N$51
  Top 1.016: U$5.PIN9 155.11,168.74 156.21,167.64 J29.1
N$53
  Top 1.016: U$6.1 162.12,167.2 161.29,166.37 161.29,154.94 163.83,152.4 J30.7
N$54
  Top 1.016: U$6.2 163.83,162.24 163.83,156.21 166.37,153.67 J30.6
N$55
  Top 1.016: U$6.3 166.81,157.04 168.91,154.94 J30.5
N$56
  Top 1.016: U$6.4 171.45,157.8 J30.4
N$57
  Top 1.016: U$6.5 173.99,160.02 J30.3
N$58
  Top 1.016: U$6.6 176.53,162.24 J30.2
N$59
  Top 1.016: U$6.7 178.24,167.2 179.07,166.37 J30.1
N$62
  Top 1.016: U$7.1 35.12,80.84 34.29,80.01 J35.7
N$63
  Top 1.016: U$7.2 36.83,75.88 J35.6
N$64
  Top 1.016: U$7.3 39.37,73.66 J35.5
N$65
  Top 1.016: U$7.4 41.91,71.44 J35.4
N$66
  Top 1.016: U$7.5 46.55,70.68 44.45,68.58 J35.3
N$67
  Top 1.016: U$7.6 49.53,75.88 49.53,69.85 46.99,67.31 J35.2
N$68
  Top 1.016: U$7.7 51.24,80.84 52.07,80.01 52.07,68.58 49.53,66.04 J35.1
N$70
  Top 1.016: U$8.PIN1 58.16,82.29 57.15,81.28 J32.9
N$71
  Top 1.016: U$8.PIN2 60.25,79.3 59.69,78.74 J32.8
N$72
  Top 1.016: U$8.PIN3 62.23,74.83 J32.7
N$73
  Top 1.016: U$8.PIN4 64.77,72.24 J32.6
N$74
  Top 1.016: U$8.PIN5 67.31,70.2 J32.5
N$75
  Top 1.016: U$8.PIN6 72.2,69.66 69.85,67.31 J32.4
N$76
  Top 1.016: U$8.PIN7 74.93,75.17 74.93,68.58 72.39,66.04 J32.3
N$77
  Top 1.016: U$8.PIN8 76.76,79.45 77.47,78.74 77.47,67.31 74.93,64.77 J32.2
N$78
  Top 1.016: U$8.PIN9 78.91,82.38 80.01,81.28 80.01,64.77 77.47,62.23 J32.1
N$80
  Top 1.016: U$9.1 85.92,80.84 85.09,80.01 J33.7
N$81
  Top 1.016: U$9.2 87.63,75.88 J33.6
N$82
  Top 1.016: U$9.3 90.17,73.66 J33.5
N$83
  Top 1.016: U$9.4 92.71,71.44 J33.4
N$84
  Top 1.016: U$9.5 97.35,70.68 95.25,68.58 J33.3
N$85
  Top 1.016: U$9.6 100.33,75.88 100.33,69.85 97.79,67.31 J33.2
N$86
  Top 1.016: U$9.7 102.04,80.84 102.87,80.01 102.87,67.31 100.33,64.77 J33.1
N$88
  Top 1.016: U$10.PIN1 108.96,82.29 107.95,81.28 107.95,66.04 110.49,63.5 J34.9
N$89
  Top 1.016: U$10.PIN2 111.05,79.3 110.49,78.74 110.49,67.31 113.03,64.77 J34.8
N$90
  Top 1.016: U$10.PIN3 113.03,74.83 113.03,68.58 115.57,66.04 J34.7
N$91
  Top 1.016: U$10.PIN4 116.04,69.38 118.11,67.31 J34.6
N$92
  Top 1.016: U$10.PIN5 120.65,70.51 J34.5
N$93
  Top 0.508: U$10.PIN6 123.19,72.61
  Top 1.016: 123.19,72.61 J34.4
N$94
  Top 1.016: U$10.PIN7 125.73,75.17 J34.3
N$95
  Top 1.016: U$10.PIN8 127.56,79.45 128.27,78.74 J34.2
N$96
  Top 1.016: U$10.PIN9 129.71,82.38 130.81,81.28 J34.1
N$98
  Top 1.016: U$11.1 136.72,80.84 135.89,80.01 135.89,68.58 138.43,66.04 J31.7
N$99
  Top 1.016: U$11.2 138.43,75.88 138.43,69.85 140.97,67.31 J31.6
N$100
  Top 1.016: U$11.3 141.41,70.68 143.51,68.58 J31.5
N$101
  Top 1.016: U$11.4 146.05,71.44 J31.4
N$102
  Top 1.016: U$11.5 148.59,73.66 J31.3
N$103
  Top 1.016: U$11.6 151.13,75.88 J31.2
N$104
  Top 1.016: U$11.7 152.84,80.84 153.67,80.01 J31.1
N$106
  Top 1.016: U$12.PIN1 159.76,82.29 158.75,81.28 158.75,66.04 161.29,63.5 J36.9
N$107
  Top 1.016: U$12.PIN2 161.85,79.3 161.29,78.74 161.29,67.31 163.83,64.77 J36.8
N$108
  Top 1.016: U$12.PIN3 163.83,74.83 163.83,68.58 166.37,66.04 J36.7
N$109
  Top 1.016: U$12.PIN4 166.84,69.38 168.91,67.31 J36.6
N$110
  Top 1.016: U$12.PIN5 171.45,70.51 J36.5
N$111
  Top 1.016: U$12.PIN6 173.99,72.61 J36.4
N$112
  Top 1.016: U$12.PIN7 176.53,75.17 J36.3
N$113
  Top 1.016: U$12.PIN8 178.36,79.45 179.07,78.74 J36.2
N$114
  Top 1.016: U$12.PIN9 180.51,82.38 181.61,81.28 J36.1

### Text on the board
Top: NPOOLE2022
tPlace: BREADBOARD | BREADBOARD